# EAGLE design schematic (EAGLE 6.2)
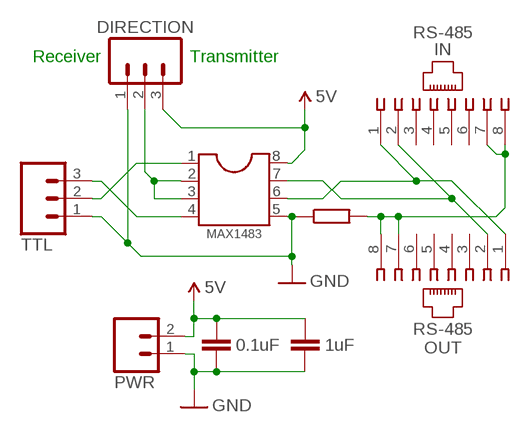
[diagram p0: schematic, sheet 1]

## Parts
B1  100R  R-EU_0207/10  [0207/10]
C1  0.1uF  C-EU025-025X050  [C025-025X050]
C2  1uF  CAPPTH1  [CAP-PTH-5MM]
DIRECTION  M03LOCK  [1X03_LOCK]
IN  RS-485  215877-4  [215877-4]
MAX1483  DIL8S  [SOCKET-08]
OUT  RS-485  215877-4  [215877-4]
PWR  M023.5MM  [SCREWTERMINAL-3.5MM-2]
TTL  M03SCREW  [SCREWTERMINAL-3.5MM-3]

## Nets
5V: C1.1 C2.2 DIRECTION.3 MAX1483.8 PWR.2
GND: B1.1 C1.2 C2.1 DIRECTION.1 MAX1483.5 PWR.1 TTL.1
N$1: DIRECTION.2 MAX1483.2 MAX1483.3
N$3: MAX1483.4 TTL.3
N$4: MAX1483.1 TTL.2
N$5: B1.2 IN.7 IN.8 OUT.7 OUT.8
N$6: IN.1 MAX1483.6 OUT.1
N$8: IN.2 MAX1483.7 OUT.2
Unconnected: IN.3 IN.4 IN.5 IN.6 OUT.3 OUT.4 OUT.5 OUT.6

## Notes on the sheet
- Receiver | Transmitter

## Library data of the parts
B1 = rcl:R-EU_: RESISTOR, European symbol
C1 = rcl:C-EU: CAPACITOR, European symbol
C2 = SparkFun:CAP: Capacitor Standard 0603 ceramic capacitor, and 0.1" leaded capacitor.
DIRECTION TTL = SparkFun:M03: Header 3 Standard 3-pin 0.1" header. Use with straight break away headers (SKU : PRT-00116), right angle break away headers (PRT-00553), swiss pins (PRT-00743), machine pins (PRT-00117), and female headers (PRT-00115). Molex polarized connector foot print use with SKU : PRT-08232 with associated crimp pins and housings.
IN OUT = con-amp:215877-4: AMP connector
MAX1483 = ic-package:DIL8: Dual In Line / Socket
PWR = SparkFun:M02: Header 2 Standard 2-pin 0.1" header. Use with straight break away headers (SKU : PRT-00116), right angle break away headers (PRT-00553), swiss pins (PRT-00743), machine pins (PRT-00117), and female headers (PRT-00115). Molex polarized connector foot print use with SKU : PRT-08233 with associated crimp pins and housings.

## Board
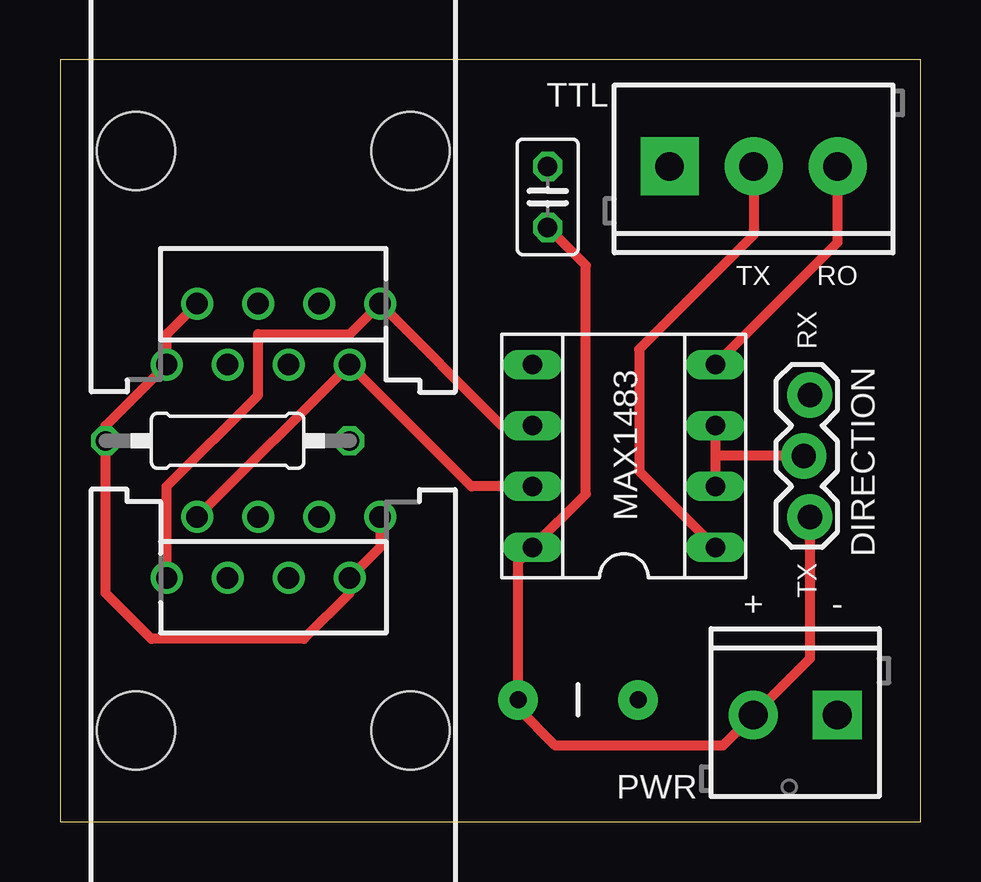
[diagram p1: board, top side]
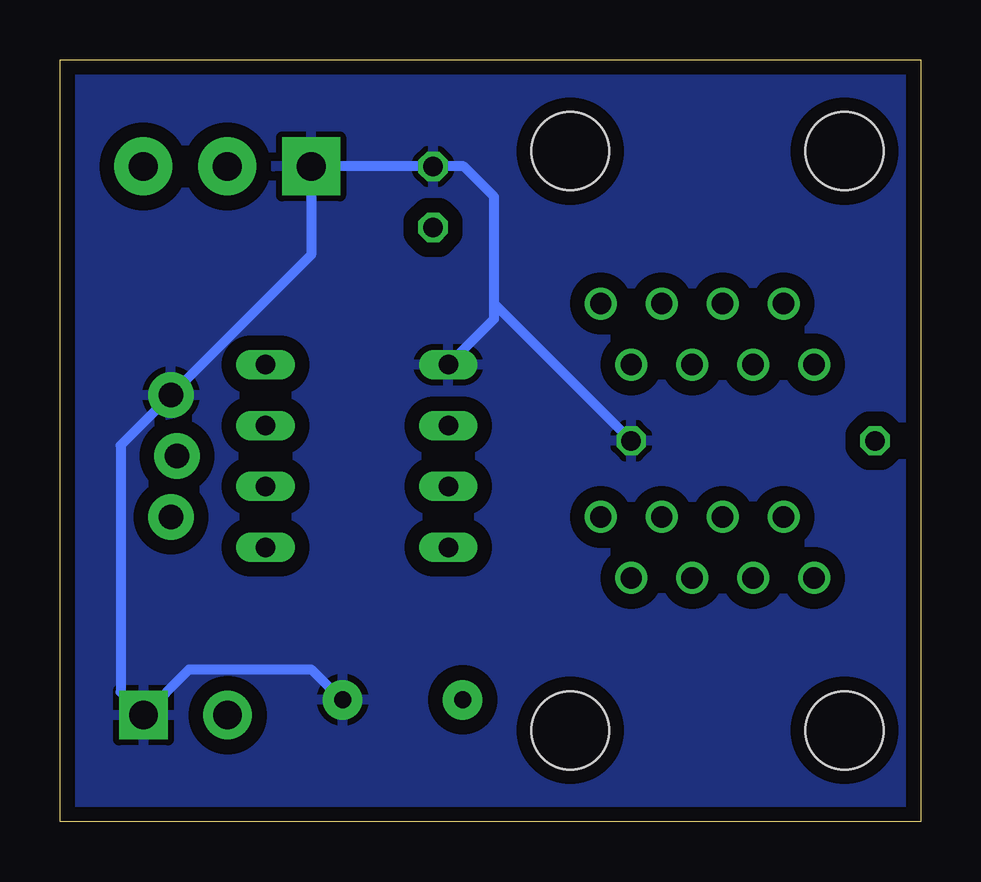
[diagram p2: board, bottom side, seen from below]

Size 35.87 x 31.74 mm. Coordinates in mm from the lower left corner, seen from the top.
Outline: 0,0 35.87,0 35.87,31.74 0,31.74 0,0
Copper layers (1*16): Top 0.0356mm / dielectric 1.5011mm / Bottom 0.0356mm
Design rules: minimum track width 6mil, minimum drill 13mil, track to track 6mil, track to pad 6mil, pad to pad 6mil, via to via 6mil, smd to smd 6mil, copper to edge 15mil, drill to drill 6mil, minimum pad ring 7mil, minimum via ring 7mil, stop-mask expansion 4mil, vias tented up to drill 0mil, thermal gap 10mil

### Footprints (pad centres in the part's own frame; a part is rotated, then mirrored left to right if it is on the bottom)
0207/10 = drill 0.813 octagon: 1 -5.08,0; 2 5.08,0
C025-025X050 = drill 0.813 octagon: 1 -1.27,0; 2 1.27,0
CAP-PTH-5MM = drill 0.7 pad 1.651: 1 -2.5,0; 2 2.5,0
1X03_LOCK = drill 1.016 pad 1.88: 1 0,0.127; 2 2.54,-0.127; 3 5.08,0.127
215877-4 = drill 0.889: 1 -4.445,6.35; 2 -3.175,8.89; 3 -1.905,6.35; 4 -0.635,8.89; 5 0.635,6.35; 6 1.905,8.89; 7 3.175,6.35; 8 4.445,8.89 | hole 3.251: -5.715,0; 5.715,0
SOCKET-08 = drill 0.813 long: 1 -3.81,-3.81; 2 -1.27,-3.81; 3 1.27,-3.81; 4 3.81,-3.81; 5 3.81,3.81; 6 1.27,3.81; 7 -1.27,3.81; 8 -3.81,3.81
SCREWTERMINAL-3.5MM-2 = drill 1.2 pad 2.032 square: 1 0,0 | drill 1.2 pad 2.032: 2 3.5,0
SCREWTERMINAL-3.5MM-3 = drill 1.2 pad 2.413 square: 1 0,0 | drill 1.2 pad 2.413: 2 3.5,0; 3 7,0

### Placement (x,y rotation side)
B1  6.99,15.88 180 top
C1  20.32,26.04 90 top
C2  21.59,5.08 180 top
DIRECTION  31.11,17.78 270 top
IN  8.89,3.81 0 top
MAX1483  23.5,15.24 90 top
OUT  8.89,27.94 180 top
PWR  32.38,4.45 180 top
TTL  25.4,27.3 0 top

### Tracks (layer width: path | path; a pad name or v marks a point on that pad's centre or on a via)
5V
  Top 0.406: DIRECTION.3 31.24,6.8 PWR.2 27.61,3.17 20.64,3.17 19.09,4.72 C2.2 19.09,10.84 MAX1483.8 21.91,13.65 21.91,23.18 C1.1
GND
  Bottom 0.406: B1.1 17.78,21.59 | 17.78,21.59 17.78,26.04 19.05,27.3 C1.2 TTL.1 25.4,23.62 DIRECTION.1 33.34,15.68 33.34,5.4 PWR.1 30.48,6.35 25.4,6.35 24.13,5.08 C2.1 | MAX1483.5 17.78,20.95 17.78,21.59
  pour Bottom (isolate 0.61): 0,31.75 0,0 35.88,0 35.88,31.75
N$1
  Top 0.406: MAX1483.3 27.3,15.24 | 27.3,15.24 MAX1483.2 | DIRECTION.2 27.3,15.24
N$3
  Top 0.406: MAX1483.4 32.4,24.14 TTL.3
N$4
  Top 0.406: TTL.2 28.9,24.45 24.13,19.68 24.13,14.61 MAX1483.1
N$5
  Top 0.406: OUT.7 4.45,20.32 OUT.8 1.91,16.51 B1.2 1.91,9.53 3.81,7.62 10.16,7.62 12.06,9.53 IN.7 13.34,11.43 IN.8
N$6
  Top 0.406: MAX1483.6 18.41,16.51 OUT.1 12.06,20.32 8.26,20.32 8.26,17.78 4.45,13.97 IN.1
N$8
  Top 0.406: MAX1483.7 17.14,13.97 OUT.2 IN.2

### Text on the board
tNames: TX | RO | RX | TX | + | -